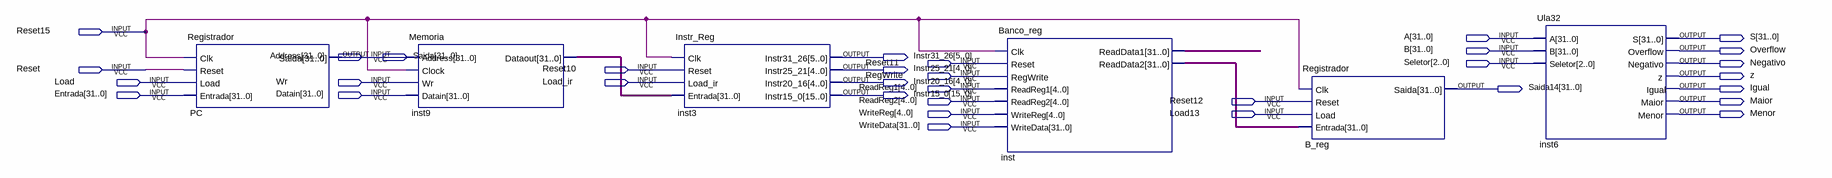
[diagram p0: schematic sheet]
// Quartus schematic thunderBolt.bdf as structural Verilog: 6 symbols, 33 pins
module thunderBolt (
  input  Reset15,
  input  [31:0] A,
  input  [31:0] B,
  input  [31:0] Address,
  input  Reset11,
  input  [2:0] Seletor,
  input  Reset,
  input  Reset10,
  input  RegWrite,
  input  Load,
  input  Wr,
  input  Load_ir,
  input  [4:0] ReadReg1,
  input  [31:0] Entrada,
  input  [31:0] Datain,
  input  [4:0] ReadReg2,
  input  Reset12,
  input  [4:0] WriteReg,
  input  Load13,
  input  [31:0] WriteData,
  output [31:0] S,
  output Overflow,
  output [31:0] Saida,
  output [5:0] Instr31_26,
  output Negativo,
  output [4:0] Instr25_21,
  output z,
  output [4:0] Instr20_16,
  output [31:0] Saida14,
  output Igual,
  output [15:0] Instr15_0,
  output Maior,
  output Menor
);

  wire [31:0] inst9_dataout, inst_readdata1, inst_readdata2;

  Registrador PC (.Clk(Reset15), .Reset(Reset), .Load(Load), .Entrada(Entrada), .Saida(Saida));
  Memoria inst9 (.Address(Address), .Clock(Reset15), .Wr(Wr), .Datain(Datain), .Dataout(inst9_dataout));
  Instr_Reg inst3 (
    .Clk(Reset15), .Reset(Reset10), .Load_ir(Load_ir), .Entrada(inst9_dataout), .Instr31_26(Instr31_26),
    .Instr25_21(Instr25_21), .Instr20_16(Instr20_16), .Instr15_0(Instr15_0));
  Banco_reg inst (
    .Clk(Reset15), .Reset(Reset11), .RegWrite(RegWrite), .ReadReg1(ReadReg1), .ReadReg2(ReadReg2),
    .WriteReg(WriteReg), .WriteData(WriteData), .ReadData1(inst_readdata1), .ReadData2(inst_readdata2));
  Registrador B_reg (.Clk(Reset15), .Reset(Reset12), .Load(Load13), .Entrada(inst_readdata2), .Saida(Saida14));
  Ula32 inst6 (
    .A(A), .B(B), .Seletor(Seletor), .S(S), .Overflow(Overflow), .Negativo(Negativo), .z(z), .Igual(Igual),
    .Maior(Maior), .Menor(Menor));
endmodule
